# EAGLE design module (EAGLE 9.6.2)

## Sheet 1 of 4
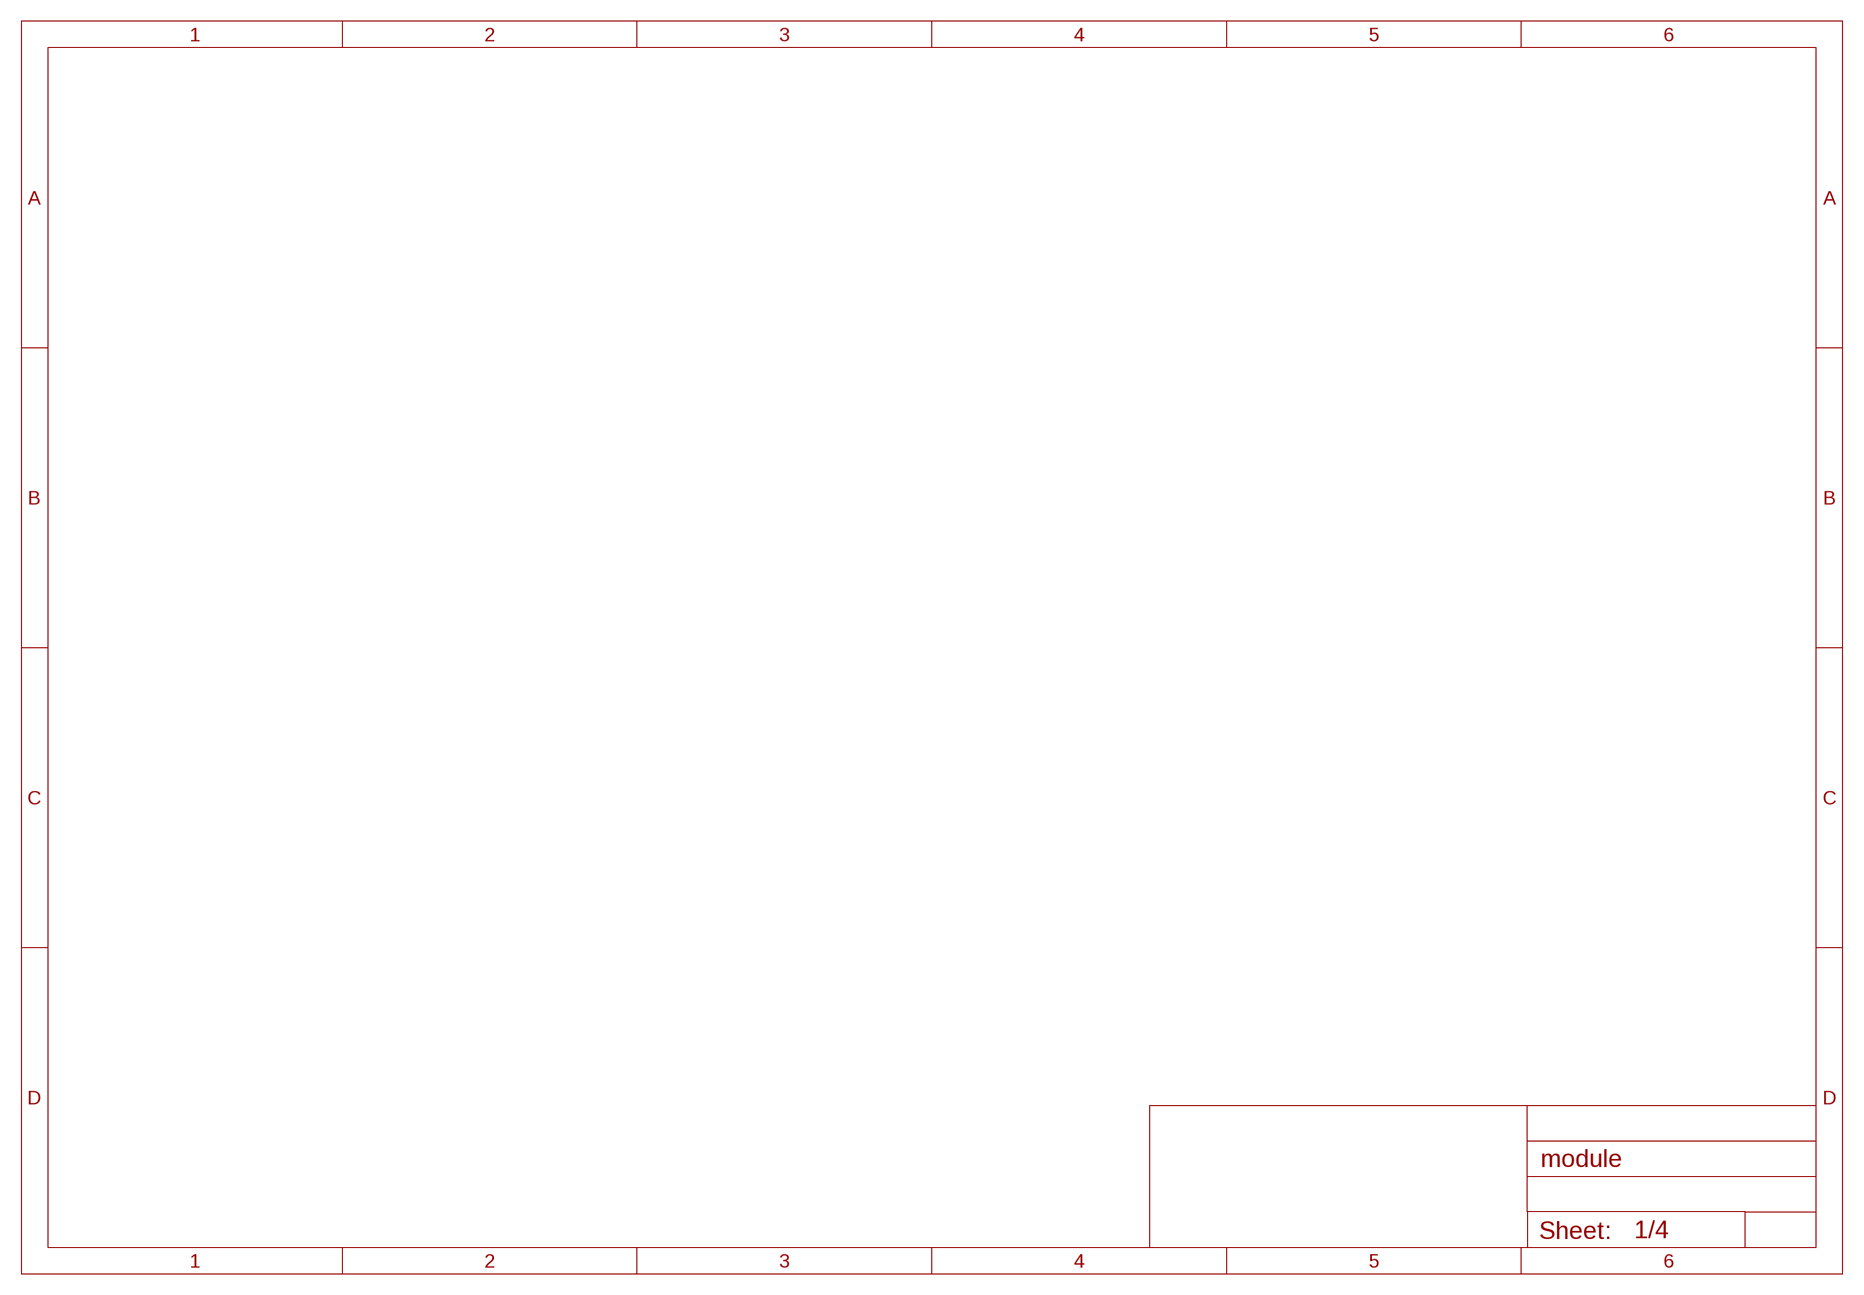
[diagram p0: schematic, sheet 1]

## Sheet 2 of 4
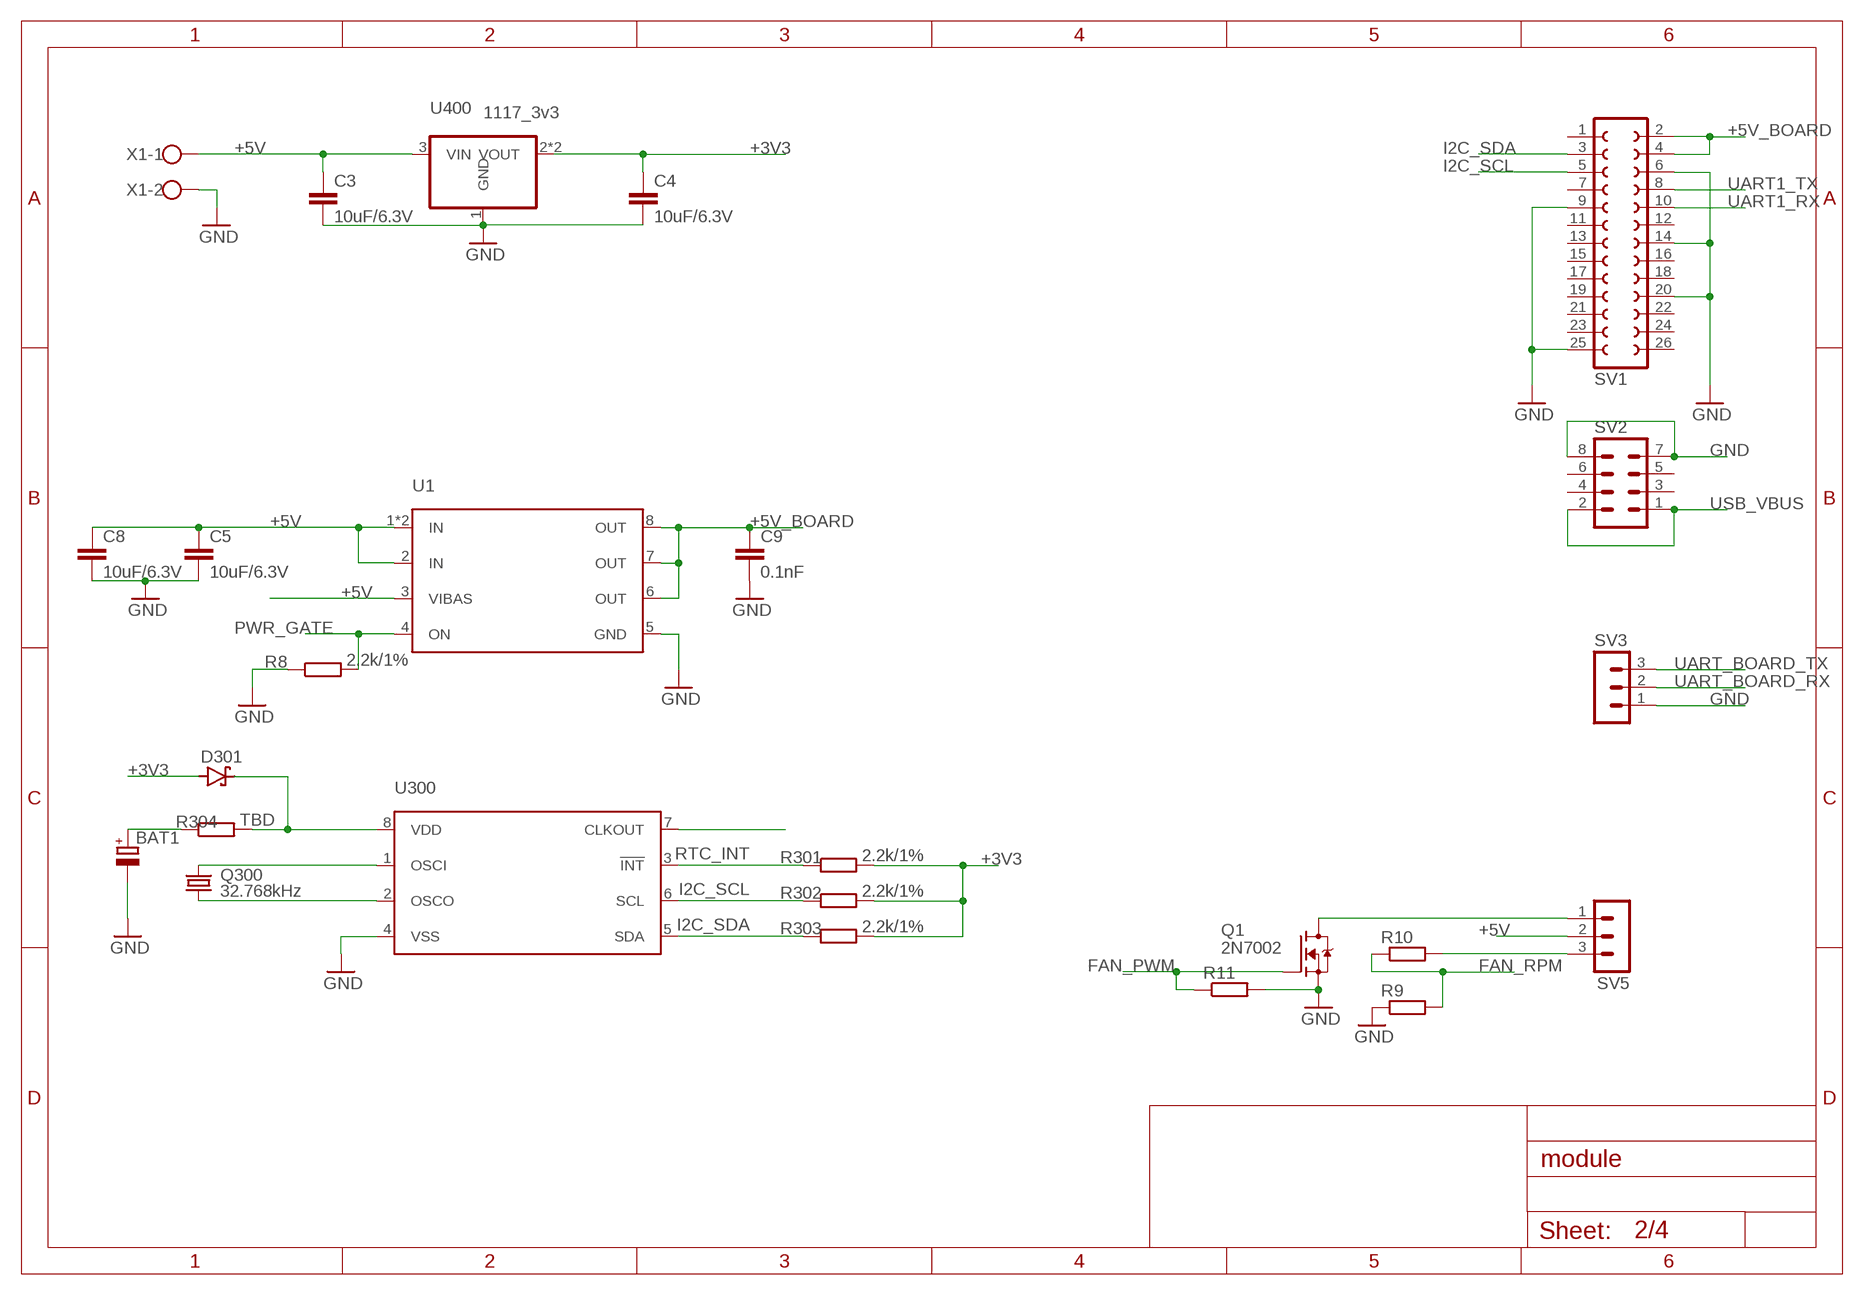
[diagram p1: schematic, sheet 2]

### Parts
BAT1  DCK-3R3E224U-E  [621]
C3  10uF/6.3V  C-EUC1206  [C1206]
C4  10uF/6.3V  C-EUC1206  [C1206]
C5  10uF/6.3V  C-EUC0603  [C0603]
C8  10uF/6.3V  C-EUC0603  [C0603]
C9  0.1nF  C-EUC0603  [C0603]
D301  NSR0320  [SOD323]
Q1  2N7002  [SOT95P240X110-3]
Q300  32.768kHz  CFPX–217-NHT  [3215]
R8  2.2k/1%  R-EU_R0603  [R0603]
R9  R-EU_R0603  [R0603]
R10  R-EU_R0603  [R0603]
R11  R-EU_R0603  [R0603]
R301  2.2k/1%  R-EU_R0603  [R0603]
R302  2.2k/1%  R-EU_R0603  [R0603]
R303  2.2k/1%  R-EU_R0603  [R0603]
R304  TBD  R-EU_R0603  [R0603]
SV1  FE13-2  [FE13-2]
SV2  MA04-2  [MA04-2]
SV3  MA03-1FEMALE  [MA03-1]
SV5  MA03-1  [MA03-1]
U1  DML10M8LDS  [SON65P300X300X80-9T160X240N]
U300  PCF85063ATT  [SOP65P490X110-8N]
U400  1117_3v3  LD1117S50  [SOT230P700X180-4]
X1  W237-102  [EBBA]

### Nets
+3V3: C4.1 D301.A R301.2 R302.2 R303.2 U400.2(VOUT) U400.4(VOUT) ; also sheet 3,4
+5V: C3.1 C5.1 C8.1 SV5.2 U1.1(IN) U1.2(IN) U1.3(VIBAS) U1.9(IN) U400.3(VIN) X1.1
+5V_BOARD: C9.1 SV1.2 SV1.4 U1.6(OUT) U1.7(OUT) U1.8(OUT)
FAN_PWM: Q1.1(G) R11.1 ; also sheet 4
FAN_RPM: R9.2 R10.1 ; also sheet 4
GND: BAT1.- C3.2 C4.2 C5.2 C8.2 C9.2 Q1.2(S) R8.1 R9.1 R11.2 SV1.6 SV1.9 SV1.14 SV1.20 SV1.25 SV2.7 SV2.8 SV3.1 U1.5(GND) U300.4(VSS) U400.1(GND) X1.2 ; also sheet 3,4
I2C_SCL: R302.1 SV1.5 U300.6(SCL) ; also sheet 4
I2C_SDA: R303.1 SV1.3 U300.5(SDA) ; also sheet 4
N$11: U300.7(CLKOUT)
N$14: Q1.3(D) SV5.1
N$16: R10.2 SV5.3
N$21: Q300.1 U300.2(OSCO)
N$22: Q300.2 U300.1(OSCI)
N$23: BAT1.+ R304.1
N$25: D301.K(C) R304.2 U300.8(VDD)
PWR_GATE: R8.2 U1.4(ON) ; also sheet 4
RTC_INT: R301.1 U300.3(!INT)
UART1_RX: SV1.10
UART1_TX: SV1.8
UART_BOARD_RX: SV3.2 ; also sheet 4
UART_BOARD_TX: SV3.3 ; also sheet 4
USB_VBUS: SV2.1 SV2.2
Unconnected: SV1.1 SV1.7 SV1.11 SV1.12 SV1.13 SV1.15 SV1.16 SV1.17 SV1.18 SV1.19 SV1.21 SV1.22 SV1.23 SV1.24 SV1.26 SV2.3 SV2.4 SV2.5 SV2.6

## Sheet 3 of 4
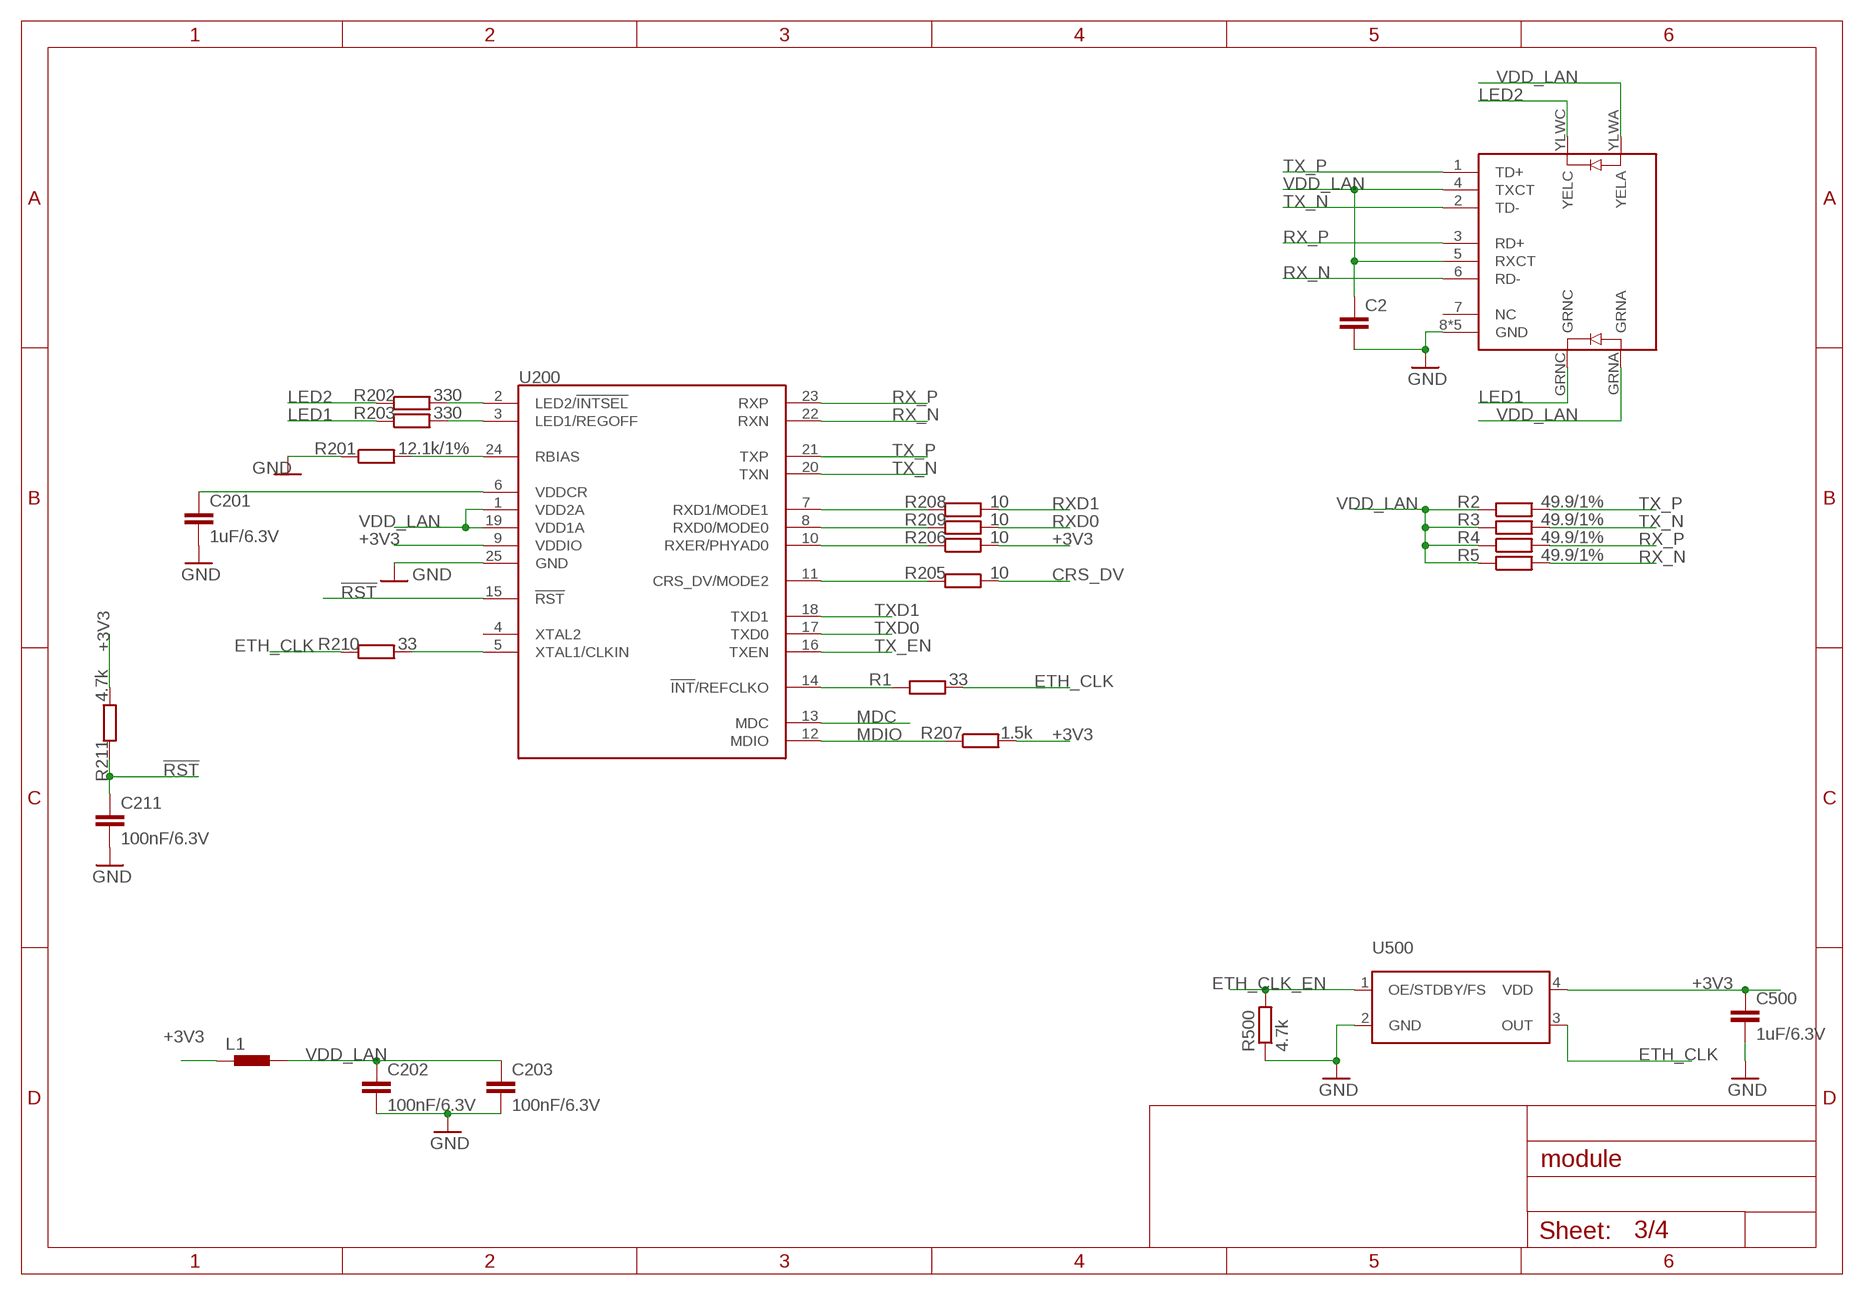
[diagram p2: schematic, sheet 3]

### Parts
C2  C-EUC0603  [C0603]
C201  1uF/6.3V  C-EUC0603  [C0603]
C202  100nF/6.3V  C-EUC0603  [C0603]
C203  100nF/6.3V  C-EUC0603  [C0603]
C211  100nF/6.3V  C-EUC0603  [C0603]
C500  1uF/6.3V  C-EUC0603  [C0603]
J1  ARJM11X1009XXXXX  [LAYOUT1-HORIZ-LEDS]
L1  FER-0603  [FER0603]
R1  33  R-EU_R0603  [R0603]
R2  49.9/1%  R-EU_R0603  [R0603]
R3  49.9/1%  R-EU_R0603  [R0603]
R4  49.9/1%  R-EU_R0603  [R0603]
R5  49.9/1%  R-EU_R0603  [R0603]
R201  12.1k/1%  R-EU_R0603  [R0603]
R202  330  R-EU_R0603  [R0603]
R203  330  R-EU_R0603  [R0603]
R205  10  R-EU_R0603  [R0603]
R206  10  R-EU_R0603  [R0603]
R207  1.5k  R-EU_R0603  [R0603]
R208  10  R-EU_R0603  [R0603]
R209  10  R-EU_R0603  [R0603]
R210  33  R-EU_R0603  [R0603]
R211  4.7k  R-EU_R0603  [R0603]
R500  4.7k  R-EU_R0603  [R0603]
U200  LAN8720A  [QFN50P400X400X100-25T250N]
U500  DSC61XXC  [DIODFN250X200X89-4N]

### Nets
!RST: C211.1 R211.1 U200.15(!RST)
+3V3: C500.1 L1.1 R206.2 R207.2 R211.2 U200.9(VDDIO) U500.4(VDD) ; also sheet 2,4
CRS_DV: R205.2 ; also sheet 4
ETH_CLK: R1.2 R210.1 U500.3(OUT) ; also sheet 4
ETH_CLK_EN: R500.2 U500.1(OE/STDBY/FS) ; also sheet 4
GND: C2.2 C201.2 C202.2 C203.2 C211.2 C500.2 J1.8(GND) J1.P$1(GND) J1.P$2(GND) J1.P$3(GND) J1.P$4(GND) R201.1 R500.1 U200.25(GND) U500.2(GND) ; also sheet 2,4
LED1: J1.GRNC R203.1
LED2: J1.YLWC(YELC) R202.1
MDC: U200.13(MDC) ; also sheet 4
MDIO: R207.1 U200.12(MDIO) ; also sheet 4
N$1: R208.1 U200.7(RXD1/MODE1)
N$2: R210.2 U200.5(XTAL1/CLKIN)
N$3: C201.1 U200.6(VDDCR)
N$4: R202.2 U200.2(LED2/!INTSEL)
N$5: R203.2 U200.3(LED1/REGOFF)
N$7: R209.1 U200.8(RXD0/MODE0)
N$8: R201.2 U200.24(RBIAS)
N$10: R206.1 U200.10(RXER/PHYAD0)
N$13: R205.1 U200.11(CRS_DV/MODE2)
N$17: R1.1 U200.14(!INT!/REFCLKO)
RX_N [eth_diff]: J1.6(RD-) R5.2 U200.22(RXN)
RX_P [eth_diff]: J1.3(RD+) R4.2 U200.23(RXP)
RXD0: R209.2 ; also sheet 4
RXD1: R208.2 ; also sheet 4
TX_EN: U200.16(TXEN) ; also sheet 4
TX_N [eth_diff]: J1.2(TD-) R3.2 U200.20(TXN)
TX_P [eth_diff]: J1.1(TD+) R2.2 U200.21(TXP)
TXD0: U200.17(TXD0) ; also sheet 4
TXD1: U200.18(TXD1) ; also sheet 4
VDD_LAN: C2.1 C202.1 C203.1 J1.4(TXCT) J1.5(RXCT) J1.GRNA J1.YLWA(YELA) L1.2 R2.1 R3.1 R4.1 R5.1 U200.1(VDD2A) U200.19(VDD1A)
Unconnected: J1.7(NC) U200.4(XTAL2)

## Sheet 4 of 4
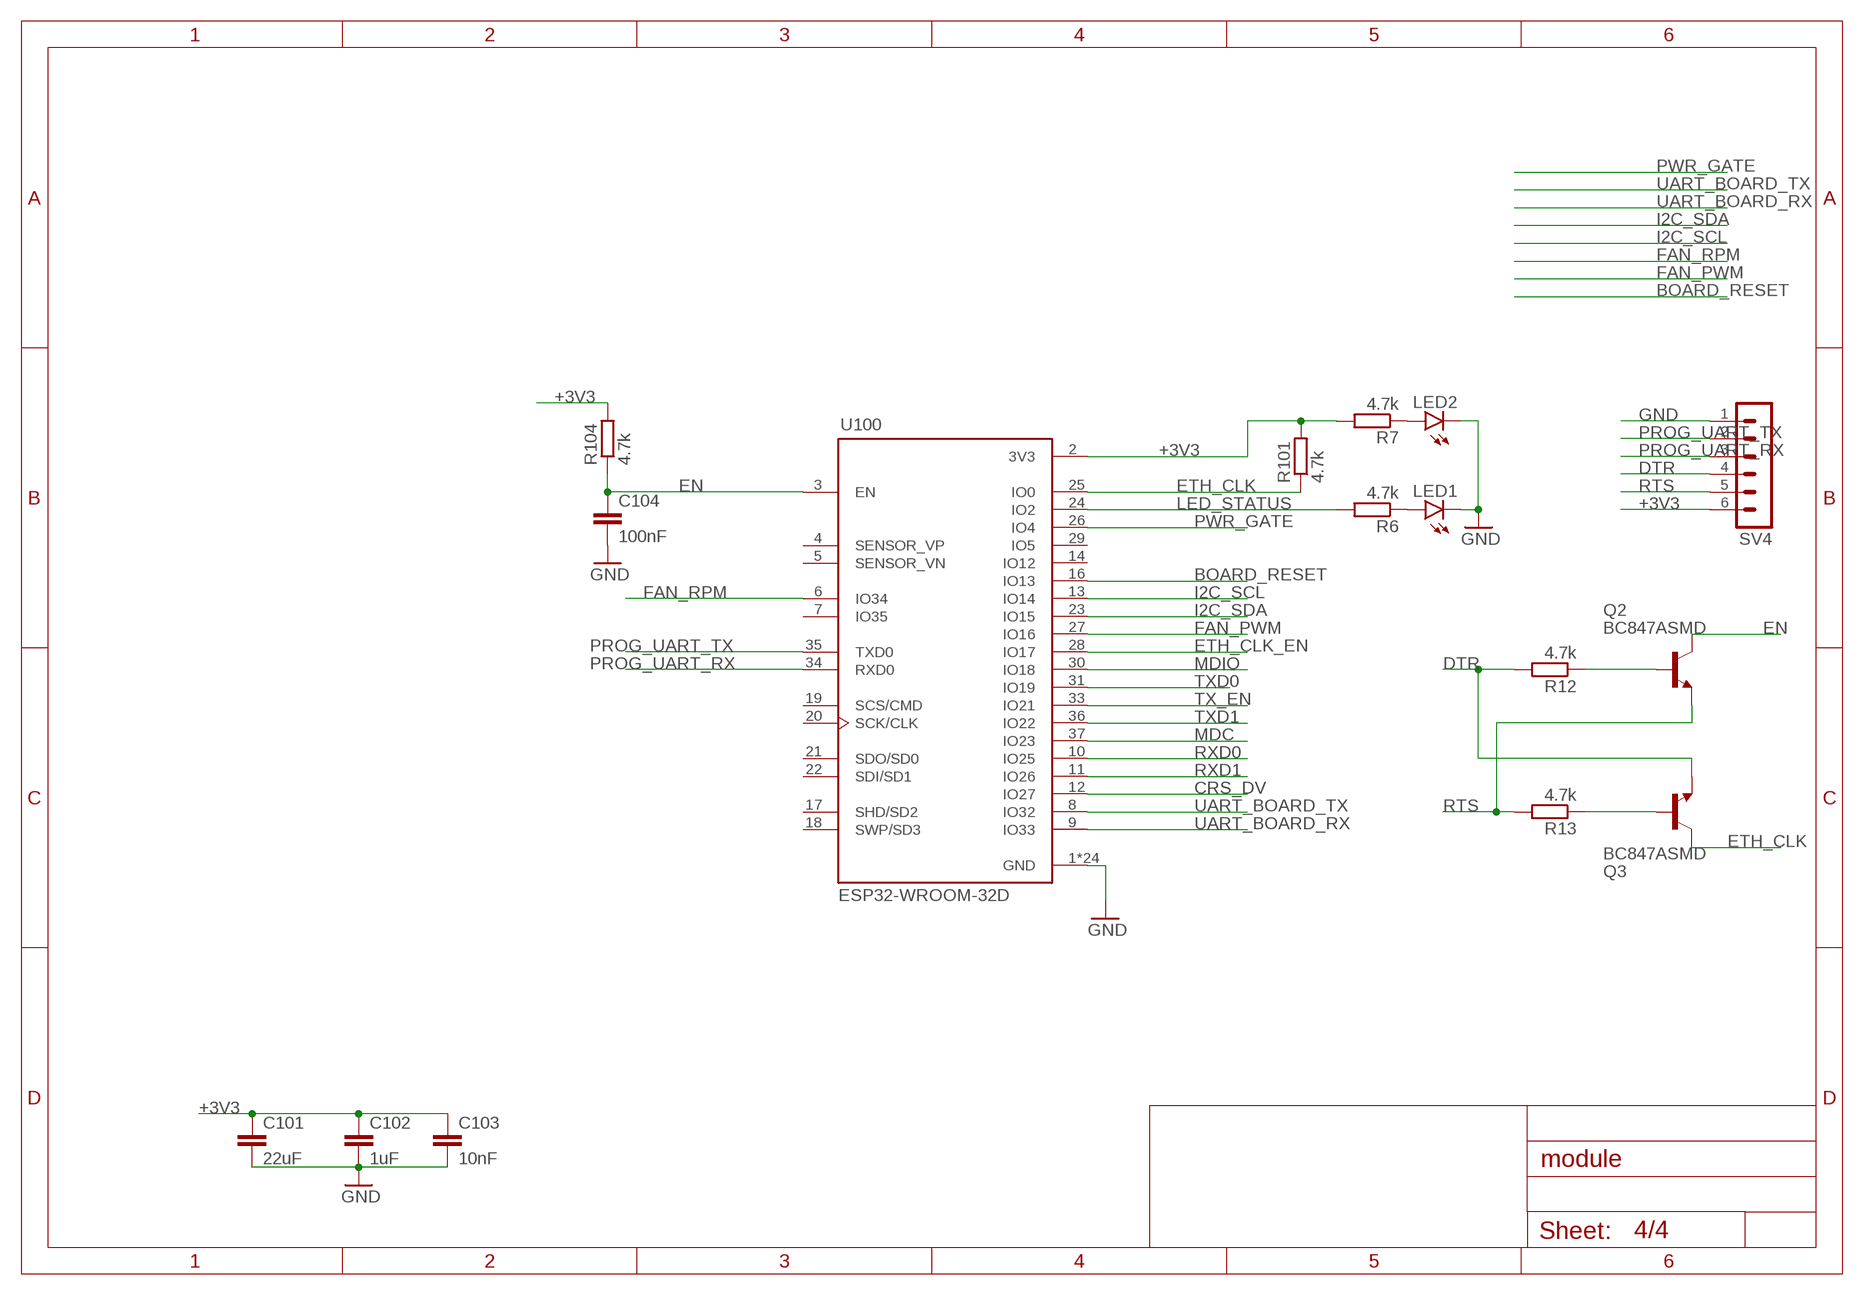
[diagram p3: schematic, sheet 4]

### Parts
C101  22uF  C-EUC1206  [C1206]
C102  1uF  C-EUC0603  [C0603]
C103  10nF  C-EUC0603  [C0603]
C104  100nF  C-EUC0603  [C0603]
LED1  LEDCHIP-LED0805  [CHIP-LED0805]
LED2  LEDCHIP-LED0805  [CHIP-LED0805]
Q2  BC847ASMD  [SOT23]
Q3  BC847ASMD  [SOT23]
R6  4.7k  R-EU_R0603  [R0603]
R7  4.7k  R-EU_R0603  [R0603]
R12  4.7k  R-EU_R0603  [R0603]
R13  4.7k  R-EU_R0603  [R0603]
R101  4.7k  R-EU_R0603  [R0603]
R104  4.7k  R-EU_R0603  [R0603]
SV4  CONN-1X6  [MA06-1]
U100  ESP32-WROOM-32D  [MODULE_ESP32-WROOM-32D]

### Nets
+3V3: C101.1 C102.1 C103.1 R7.2 R101.2 R104.2 SV4.6 U100.2(3V3) ; also sheet 2,3
BOARD_RESET: U100.16(IO13)
CRS_DV: U100.12(IO27) ; also sheet 3
DTR: Q3.2(E) R12.2 SV4.4
EN: C104.1 Q2.3(C) R104.1 U100.3(EN)
ETH_CLK: Q3.3(C) R101.1 U100.25(IO0) ; also sheet 3
ETH_CLK_EN: U100.28(IO17) ; also sheet 3
FAN_PWM: U100.27(IO16) ; also sheet 2
FAN_RPM: U100.6(IO34) ; also sheet 2
GND: C101.2 C102.2 C103.2 C104.2 LED1.C LED2.C SV4.1 U100.1(GND) U100.15(GND) U100.38(GND) U100.39_1(GND) U100.39_2(GND) U100.39_3(GND) U100.39_4(GND) U100.39_5(GND) U100.39_6(GND) U100.39_7(GND) U100.39_8(GND) U100.39_9(GND) U100.39_10(GND) U100.39_11(GND) U100.39_12(GND) U100.39_13(GND) U100.39_14(GND) U100.39_15(GND) U100.39_16(GND) U100.39_17(GND) U100.39_18(GND) U100.39_19(GND) U100.39_20(GND) U100.39_21(GND) ; also sheet 2,3
I2C_SCL: U100.13(IO14) ; also sheet 2
I2C_SDA: U100.23(IO15) ; also sheet 2
LED_STATUS: R6.2 U100.24(IO2)
MDC: U100.37(IO23) ; also sheet 3
MDIO: U100.30(IO18) ; also sheet 3
N$9: LED1.A R6.1
N$12: LED2.A R7.1
N$19: Q2.1(B) R12.1
N$20: Q3.1(B) R13.1
PROG_UART_RX: SV4.3 U100.34(RXD0)
PROG_UART_TX: SV4.2 U100.35(TXD0)
PWR_GATE: U100.26(IO4) ; also sheet 2
RTS: Q2.2(E) R13.2 SV4.5
RXD0: U100.10(IO25) ; also sheet 3
RXD1: U100.11(IO26) ; also sheet 3
TX_EN: U100.33(IO21) ; also sheet 3
TXD0: U100.31(IO19) ; also sheet 3
TXD1: U100.36(IO22) ; also sheet 3
UART_BOARD_RX: U100.9(IO33) ; also sheet 2
UART_BOARD_TX: U100.8(IO32) ; also sheet 2
Unconnected: U100.4(SENSOR_VP) U100.5(SENSOR_VN) U100.7(IO35) U100.14(IO12) U100.17(SHD/SD2) U100.18(SWP/SD3) U100.19(SCS/CMD) U100.20(SCK/CLK) U100.21(SDO/SD0) U100.22(SDI/SD1) U100.29(IO5)

## Library data of the parts
BAT1 = parts-elna:DCK-3R3E224U-E
C2-C5 C8 C9 C101-C104 C201-C203 C211 C500 = rcl:C-EU: CAPACITOR, European symbol; SPICEPREFIX: C
D301 = parts-onsemi:NSR0320
J1 = parts-abracon:ARJM11: Check prices <https://pricing.snapeda.com/parts/ARJM11A3-009-AB-ER2-T/Abracon%20LLC/view-part?ref=eda>
L1 = parts-passives:FER-
LED1 LED2 = led:LED: LED OSRAM: - CHIPLED LG R971, LG N971, LY N971, LG Q971, LY Q971, LO R971, LY R971 LH N974, LH R974 LS Q976, LO Q976, LY Q976 LO Q996 - Hyper CHIPLED LW Q18S LB Q993, LB Q99A, LB R99A - SideLED LS A670, LO A670, LY A670, LG A670, LP A670 LB A673, LV A673, LT A673, LW A673 LH A674 LY A675 LS A676, LA A676, LO A676, LY A676, LW A676 LS A679, LY A679, LG A679 - Hyper Micro SIDELED® LS Y876, LA Y876, LO Y876, LY Y876 LT Y87S - SmartLED LW L88C, LW L88S LB L89C, LB L89S, LG L890 LS L89K, LO L89K, LY L89K LS L896, LA L896, LO L896, LY L896 - TOPLED LS T670, LO T670, LY T670, LG T670, LP T670 LSG T670, LSP T670, LSY T670, LOP T670, LYG T670 LG T671, LOG T671, LSG T671 LB T673, LV T673, LT T673, LW T673 LH T674 LS T676, LA T676, LO T676, LY T676, LB T676, LH T676, LSB T676, LW T676 LB T67C, LV T67C, LT T67C, LS T67K, LO T67K, LY T67K, LW E67C LS E67B, LA E67B, LO E67B, LY E67B, LB E67C, LV E67C, LT E67C LW T67C LS T679, LY T679, LG T679 LS T770, LO T770, LY T770, LG T770, LP T770 LB T773, LV T773, LT T773, LW T773 LH T774 LS E675, LA E675, LY E675, LS T675 LS T776, LA T776, LO T776, LY T776, LB T776 LHGB T686 LT T68C, LB T68C - Hyper Mini TOPLED® LB M676 - Mini TOPLED Santana® LG M470 LS M47K, LO M47K, LY M47K Source: http://www.osram.convergy.de LUXEON: - LUMILED® LXK2-PW12-R00, LXK2-PW12-S00, LXK2-PW14-U00, LXK2-PW14-V00 LXK2-PM12-R00, LXK2-PM12-S00, LXK2-PM14-U00 LXK2-PE12-Q00, LXK2-PE12-R00, LXK2-PE12-S00, LXK2-PE14-T00, LXK2-PE14-U00 LXK2-PB12-K00, LXK2-PB12-L00, LXK2-PB12-M00, LXK2-PB14-N00, LXK2-PB14-P00, LXK2-PB14-Q00 LXK2-PR12-L00, LXK2-PR12-M00, LXK2-PR14-Q00, LXK2-PR14-R00 LXK2-PD12-Q00, LXK2-PD12-R00, LXK2-PD12-S00 LXK2-PH12-R00, LXK2-PH12-S00 LXK2-PL12-P00, LXK2-PL12-Q00, LXK2-PL12-R00 Source: www.luxeon.com KINGBRIGHT: KA-3528ASYC Source: www.kingbright.com
Q1 = parts-onsemi:2N7002
Q2 Q3 = transistor-npn:BC847*: NPN Transistor
Q300 = parts-iqd:CFPX–217: 32.768
R1-R13 R101 R104 R201-R203 R205-R211 R301-R304 R500 = rcl:R-EU_: RESISTOR, European symbol; SPICEPREFIX: R
SV1 = con-lsta:FE13-2: FEMALE HEADER; OC_FARNELL: unknown; OC_NEWARK: unknown
SV2 = con-lstb:MA04-2: PIN HEADER; OC_FARNELL: unknown; OC_NEWARK: unknown
SV3 = parts-passives:MA03-1: PIN HEADER; OC_FARNELL: unknown; OC_NEWARK: unknown
SV4 = parts-passives:CONN-1X6
SV5 = con-lstb:MA03-1: PIN HEADER; OC_FARNELL: unknown; OC_NEWARK: unknown
U1 = parts-diodes:DML10M8LDS
U100 = parts-espressif:ESP32-WROOM-32D: Bluetooth, WiFi 802.11b/g/n, Bluetooth v4.2 + EDR, Class 1, 2 and 3 Transceiver Module 2.4GHz ~ 2.5GHz Integrated, Trace Surface Mount Check prices <https://pricing.snapeda.com/parts/ESP32-WROOM-32D/Espressif%20Systems/view-part?ref=eda>; AVAILABILITY: Bad; DESCRIPTION: 802.11b/g/n, Bluetooth v4.2 +EDR, Class 1, 2 and 3 Transceiver Module 2.4GHz ~ 2.5GHz Integrated, Trace Surface Mount; MF: Espressif Systems; MP: ESP32-WROOM-32D; PACKAGE: Module Espressif Systems; PRICE: None
U200 = parts-microchip:LAN8720A
U300 = parts-nxp:PCF85063A
U400 = parts-st:LD1117
U500 = parts-microchip:DSC61XX
X1 = parts-adam_tech:W237-102: WAGO SCREW CLAMP

## Net classes
1 eth_diff: width 0.25 mm, drill 0.3 mm, clearance 0.25 mm

## Board
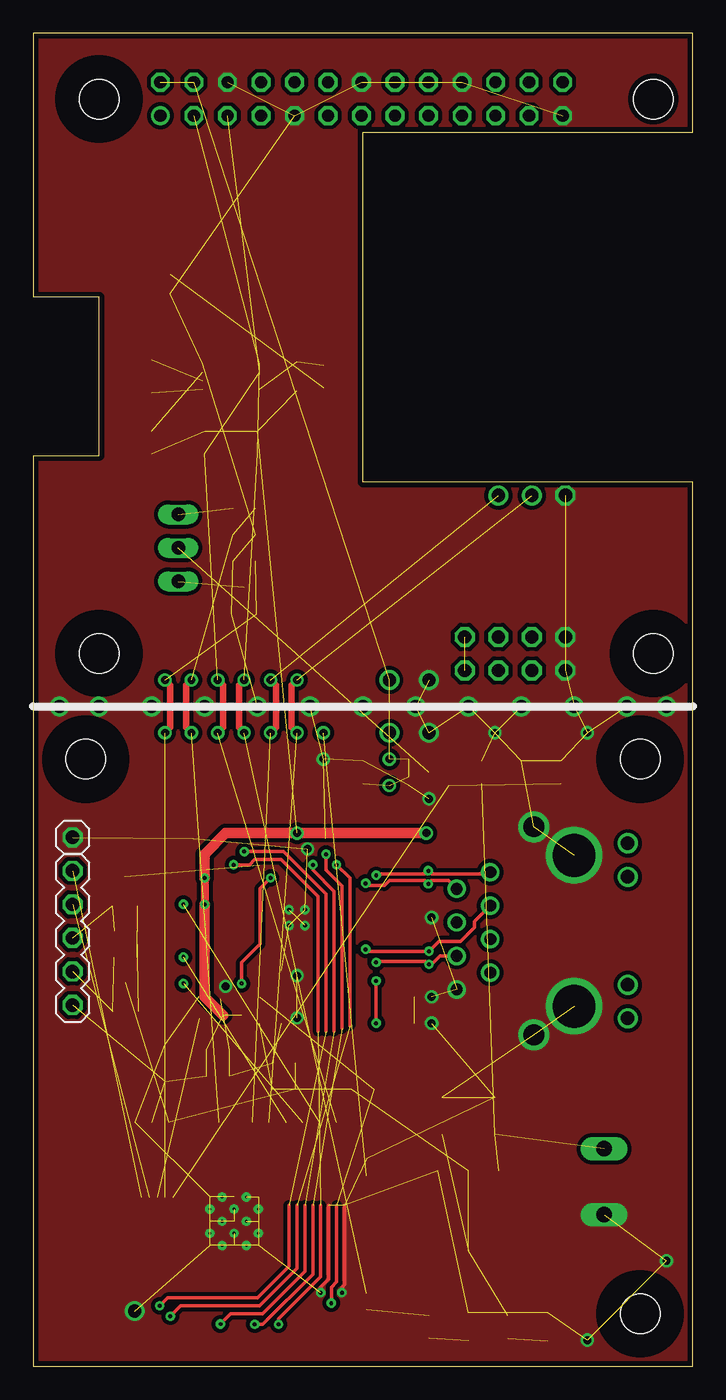
[diagram p4: board, top side]
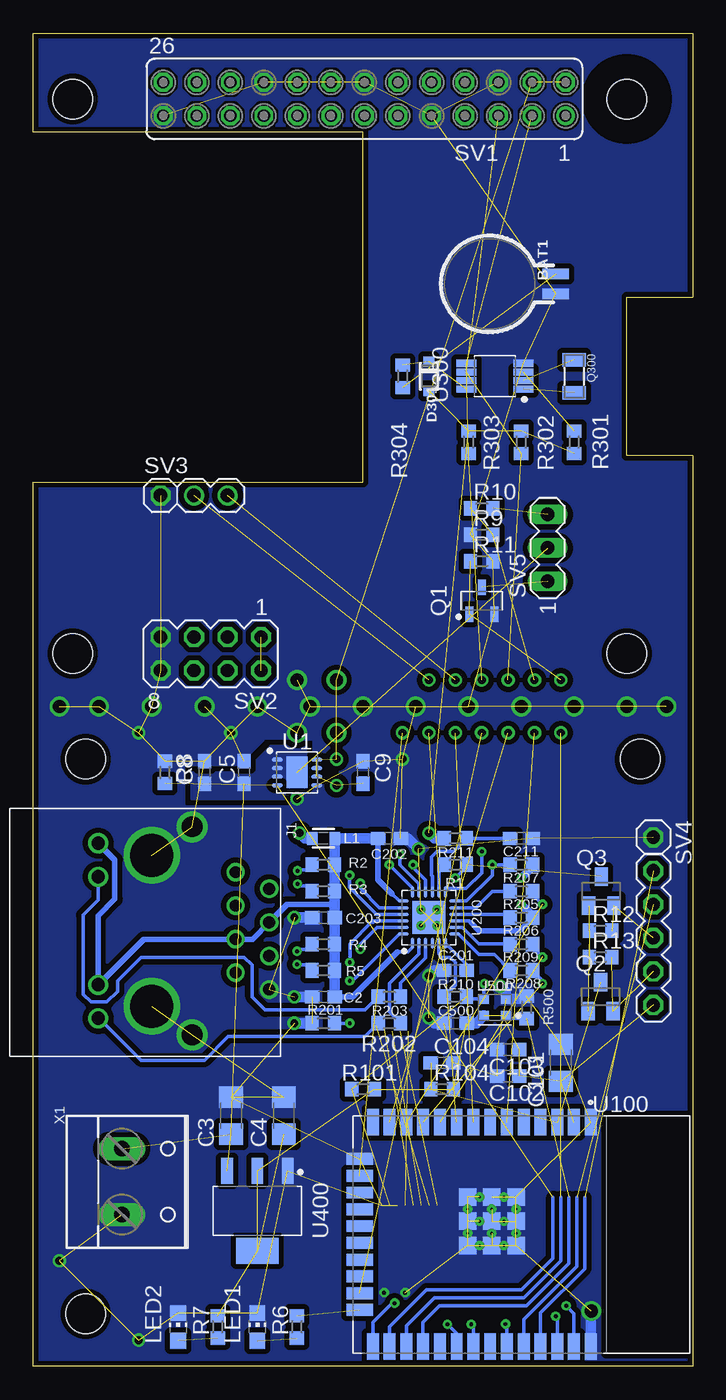
[diagram p5: board, bottom side, seen from below]

Size 50 x 101 mm. Coordinates in mm from the lower left corner, seen from the top.
Outline: 0,0 50,0 50,67 25,67 25,93.5 50,93.5 50,101 0,101 0,81 5,81 5,69 0,69 0,0
Copper layers (1*16): Top 0.035mm / dielectric 0.93mm / Bottom 0.035mm
Design rules "default *": minimum track width 6mil, minimum drill 0.3mm, track to track 6mil, track to pad 6mil, pad to pad 6mil, via to via 6mil, smd to smd 6mil, copper to edge 0.4mm, drill to drill 6mil, minimum pad ring 10mil, minimum via ring 8mil, stop-mask expansion 4mil, vias tented up to drill 0.6mm, thermal gap 10mil
Holes 3 mm at 47,54 5,54 4,46 46,4 47,96 5,96 46,46
tRestrict: area 2,51 to 8,57; area 44,51 to 50,57; area 1,43 to 7,49; area 43,1 to 49,7; area 2,93 to 8,99; area 43,43 to 49,49
bRestrict: area 2,93 to 8,99

### Footprints (pad centres in the part's own frame; a part is rotated, then mirrored left to right if it is on the bottom)
621 = smd 0.8 x 2: + 0.75,-1.6; - -0.75,-1.6
C0603 = smd 1.1 x 1: 1 -0.85,0; 2 0.85,0
C1206 = smd 1.6 x 1.8: 1 -1.4,0; 2 1.4,0
SOD323 = smd 0.8 x 0.8: A 1.1,0; K -1.1,0
LAYOUT1-HORIZ-LEDS = drill 0.89: 1 -4.445,6.35; 2 -3.175,8.89; 3 -1.905,6.35; 4 -0.635,8.89; 5 0.635,6.35; 6 1.905,8.89; 7 3.175,6.35; 8 4.445,8.89 | drill 1.02: GRNA -6.63,-4.06; GRNC -4.09,-4.06; YLWA 4.09,-4.06; YLWC 6.63,-4.06 | drill 3.25: P$1 -5.715,0; P$2 5.715,0 | drill 1.57: P$3 -7.875,3.05; P$4 7.875,3.05
FER0603 = smd 0.8 x 1: 1 -0.85,0; 2 0.85,0
CHIP-LED0805 = smd 1.2 x 1.2: A 0,-1.05; C 0,1.05
SOT95P240X110-3 = smd 1.18 x 0.609: 1 -1.024,0.95; 2 -1.024,-0.95; 3 1.024,0
SOT23 = smd 1 x 1.4: 1 -0.95,-1.1; 2 0.95,-1.1; 3 0,1.1
3215 = smd 1 x 1.8: 1 -1.25,0; 2 1.25,0
R0603 = smd 1 x 1.1: 1 -0.85,0; 2 0.85,0
FE13-2 = drill 0.914: 1 -15.24,1.27 | drill 0.914 octagon: 2 -15.24,-1.27; 3 -12.7,1.27; 4 -12.7,-1.27; 5 -10.16,1.27; 6 -10.16,-1.27; 7 -7.62,1.27; 8 -7.62,-1.27; 9 -5.08,1.27; 10 -5.08,-1.27; 11 -2.54,1.27; 12 -2.54,-1.27; 13 0,1.27; 14 0,-1.27; 15 2.54,1.27; 16 2.54,-1.27; 17 5.08,1.27; 18 5.08,-1.27; 19 7.62,1.27; 20 7.62,-1.27; 21 10.16,1.27; 22 10.16,-1.27; 23 12.7,1.27; 24 12.7,-1.27; 25 15.24,1.27; 26 15.24,-1.27
MA04-2 = drill 1.016 octagon: 1 -3.81,-1.27; 2 -3.81,1.27; 3 -1.27,-1.27; 4 -1.27,1.27; 5 1.27,-1.27; 6 1.27,1.27; 7 3.81,-1.27; 8 3.81,1.27
MA03-1 = drill 1.016 octagon: 1 -2.54,0 | drill 1.016: 2 0,0; 3 2.54,0
MA06-1 = drill 1.016 pad 1.5 octagon: 1 -5.08,0; 2 -2.54,0; 3 0,0; 4 2.54,0; 5 5.08,0; 6 7.62,0
MA03-1' = drill 1.016 long: 1 -2.54,0; 2 0,0; 3 2.54,0
SON65P300X300X80-9T160X240N = smd 0.838 x 0.32: 1 -1.5,0.975; 2 -1.5,0.325; 3 -1.5,-0.325; 4 -1.5,-0.975; 5 1.5,-0.975; 6 1.5,-0.325; 7 1.5,0.325; 8 1.5,0.975 | smd 1.6 x 2.4: 9 0,0
MODULE_ESP32-WROOM-32D = smd 2 x 0.9: 1 -8.5,5.26; 2 -8.5,3.99; 3 -8.5,2.72; 4 -8.5,1.45; 5 -8.5,0.18; 6 -8.5,-1.09; 7 -8.5,-2.36; 8 -8.5,-3.63; 9 -8.5,-4.9; 10 -8.5,-6.17; 11 -8.5,-7.44; 12 -8.5,-8.71; 13 -8.5,-9.98; 14 -8.5,-11.25; 25 8.5,-11.25; 26 8.5,-9.98; 27 8.5,-8.71; 28 8.5,-7.44; 29 8.5,-6.17; 30 8.5,-4.9; 31 8.5,-3.63; 32 8.5,-2.36; 33 8.5,-1.09; 34 8.5,0.18; 35 8.5,1.45; 36 8.5,2.72; 37 8.5,3.99; 38 8.5,5.26 | smd 0.9 x 2: 15 -5.715,-12.25; 16 -4.445,-12.25; 17 -3.175,-12.25; 18 -1.905,-12.25; 19 -0.635,-12.25; 20 0.635,-12.25; 21 1.905,-12.25; 22 3.175,-12.25; 23 4.445,-12.25; 24 5.715,-12.25 | smd 1.33 x 1.33: 39_1 -2.835,-0.405; 39_2 -1,-0.405; 39_3 0.835,-0.405; 39_4 -2.835,-2.24; 39_5 -1,-2.24; 39_6 0.835,-2.24; 39_7 -2.835,-4.075; 39_8 -1,-4.075; 39_9 0.835,-4.075 | drill 0.2 pad 0.3: 39_10 -1.917,-0.405; 39_11 -0.083,-0.405; 39_12 -2.835,-1.323; 39_13 -1,-1.323; 39_14 0.835,-1.323; 39_15 -1.917,-2.24; 39_16 -0.083,-2.24; 39_17 -2.835,-3.158; 39_18 -1,-3.158; 39_19 0.835,-3.158; 39_20 -1.917,-4.075; 39_21 -0.083,-4.075
QFN50P400X400X100-25T250N = smd 0.838 x 0.264: 1 -1.946,1.25; 2 -1.946,0.75; 3 -1.946,0.25; 4 -1.946,-0.25; 5 -1.946,-0.75; 6 -1.946,-1.25; 13 1.946,-1.25; 14 1.946,-0.75; 15 1.946,-0.25; 16 1.946,0.25; 17 1.946,0.75; 18 1.946,1.25 | smd 0.264 x 0.838: 7 -1.25,-1.946; 8 -0.75,-1.946; 9 -0.25,-1.946; 10 0.25,-1.946; 11 0.75,-1.946; 12 1.25,-1.946; 19 1.25,1.946; 20 0.75,1.946; 21 0.25,1.946; 22 -0.25,1.946; 23 -0.75,1.946; 24 -1.25,1.946 | smd 2.5 x 2.5: 25 0,0
SOP65P490X110-8N = smd 1.509 x 0.539: 1 -2.153,0.975; 2 -2.153,0.325; 3 -2.153,-0.325; 4 -2.153,-0.975; 5 2.153,-0.975; 6 2.153,-0.325; 7 2.153,0.325; 8 2.153,0.975
SOT230P700X180-4 = smd 1.965 x 0.889: 1 -3.023,2.3; 2 -3.023,0; 3 -3.023,-2.3 | smd 1.965 x 3.189: 4 3.023,0
DIODFN250X200X89-4N = smd 0.76 x 0.75: 1 -0.82,0.625; 2 -0.82,-0.625; 3 0.82,-0.625; 4 0.82,0.625
EBBA = drill 1.194 long: 1 -2.5,-1.27; 2 2.5,-1.27

### Placement (x,y rotation side)
BAT1  12,82 90 bottom
C2  28,28 180 bottom
C3  35,19 90 bottom
C4  31,19 90 bottom
C5  34,45 90 bottom
C8  37,45 90 bottom
C9  25,45 90 bottom
C101  10,23 90 bottom
C102  14,22 180 bottom
C103  14,24 180 bottom
C104  19,23 0 bottom
C201  18,30 180 bottom
C202  23,40 0 bottom
C203  28,34 180 bottom
C211  13,40 0 bottom
C500  18,26 180 bottom
D301  20,75 270 bottom
J1  41,33 270 bottom
L1  28,40 0 bottom
LED1  33,3 0 bottom
LED2  39,3 0 bottom
Q1  16,58 90 bottom
Q2  7,28 0 bottom
Q3  6.95,36 0 bottom
Q300  9,75 270 bottom
R1  18,38 0 bottom
R2  28,38 180 bottom
R3  28,36 180 bottom
R4  28,32 180 bottom
R5  28,30 180 bottom
R6  30,3 90 bottom
R7  36,3 90 bottom
R8  40,45 270 bottom
R9  16,63 0 bottom
R10  16,65 0 bottom
R11  16,61 0 bottom
R12  7,33 0 bottom
R13  7,31 0 bottom
R101  25,21 0 bottom
R104  19,21 0 bottom
R201  28,26 0 bottom
R202  23,26 0 bottom
R203  23,28 0 bottom
R205  13,36 0 bottom
R206  13,34 0 bottom
R207  13,38 0 bottom
R208  13,30 0 bottom
R209  13,32 0 bottom
R210  18,28 180 bottom
R211  18,40 180 bottom
R301  9,70 270 bottom
R302  13,70 90 bottom
R303  17,70 90 bottom
R304  22,75 90 bottom
R500  12.6,27.2 270 bottom
SV1  24.89,96 180 bottom
SV2  36.53,53.98 180 bottom
SV3  37.8,65.98 0 bottom
SV4  3,35 270 bottom
SV5  [MA03-1']  11,62 90 bottom
U1  30,45 0 bottom
U100  13,10 270 bottom
U200  20,34 90 bottom
U300  15,75 180 bottom
U400  33,11.8 270 bottom
U500  15,27.2 180 bottom
X1  42,14 270 bottom

### Tracks (layer width: path | path; a pad name or v marks a point on that pad's centre or on a via)
!RST
  Bottom 0.25: U200.15 19.75,37.15 19.8,37.2 19.8,38.6 19.4,39 18.15,39 R211.1 C211.1
+3V3  (via drill 0.3, 0.6)  (17 unrouted)
  Top 0.6: v13,37 v13,35
  Top 0.8: v29.8,40.4 v20,40.4 14.6,40.4 13,38.8 v13,37 | v13,35 13,28 14.4,26.6
  Bottom 0.25: U200.9 16.95,33.75 16.8,33.6
  Bottom 0.4: 16.8,33.6 16.2,33 13.15,33 R206.2
  Bottom 0.6: R207.2 12.15,37.85 v13,37 | v13,35 12.15,34.15 R206.2
  Bottom 0.8: R211.2 19.6,40 v20,40.4 | C500.1 16.39,26 U500.4 | L1.1 29.4,40 v29.8,40.4
+5V  (4 unrouted)
  pour Bottom (isolate 0.4, rank 3, no thermals): 29.3,47 32,47 34,45 38,45 38,43 29.3,43
+5V_BOARD  (via drill 0.6, 1)  (9 unrouted)
  other vias: 27,46 27,44 27,48 27,52
BOARD_RESET  (via drill 0.6)  (1 unrouted)
  other vias: 22,48
CRS_DV  (via drill 0.3)  (1 unrouted)
  Bottom 0.25: R205.2 12.15,35.77 v11.39,35.01
DTR  (2 unrouted)
EN  (3 unrouted)
ETH_CLK  (via drill 0.3)  (4 unrouted)
  Top 0.25: v18,37 17.2,36.2 17.2,32 15.8,30.6 v15.8,29 | v22.6,4.8 22.6,6 23,6.4 23,12.2
  Bottom 0.25: R1.2 17.15,37.85 v18,37 | R210.1 16.98,27.82 U500.3 15.82,28.98 v15.8,29 | U100.25 24.25,3.35 22.8,4.8 v22.6,4.8
ETH_CLK_EN  (1 unrouted)
  Bottom 0.25: U500.1 13.96,26.35 R500.2 | U100.28 20.44,3.36 19.2,4.6 12.6,4.6 9.4,7.8 9.4,12.8
FAN_PWM  (via drill 0.6)  (3 unrouted)
  Top 0.5: v10,52 10.4,51.6 10.4,48.4 v10,48
  Bottom 0.25: U100.27 21.71,3.09 19.6,5.2 12.8,5.2 10,8 10,12.8
FAN_RPM  (via drill 0.6)  (3 unrouted)
  Top 0.5: v12,48 11.6,48.4 11.6,51.6 v12,52
GND  (via drill 0.3, 0.6, 1)  (93 unrouted)
  Top 0.25: v21.8,5.6 21.8,6 22.4,6.6 22.4,12.2 | v23.4,5.6 23.4,6 23.6,6.2 23.6,12.2
  Bottom 0.8: C203.2 v30.2,34 | C2.2 v30.2,28 | R201.1 v30.2,26 | C202.2 21.6,40 v20.8,39.2 | C201.2 19.6,30 v20,29.6 | C500.2 19.6,26 v20,26.4 | R500.1 12.82,27.82 U500.2 14.18,28.37 v14.6,28.79 | U100.38 7.74,4.16 v7.7,4.2
  other vias: 42,48 35,48 22,46 30,43 19.4,34.6 20.6,34.6 20.6,33.4 19.4,33.4 2,50 5,50 9,50 13,50 17,50 21,50 25,50 29,50 33,50 37,50 41,50 45,50 48,50 30,48 30,52 42,2 48,8
  pour Top (isolate 0.3, rank 6, no thermals): -1,102 51,102 51,0.2 -1,0.2
  pour Bottom (isolate 0.4, rank 6, no thermals): -2,103 52,103 52,-1 -2,-1
I2C_SCL  (via drill 0.6)  (4 unrouted)
  Top 0.5: v14,48 14.4,48.4 14.4,51.6 v14,52
I2C_SDA  (via drill 0.6)  (4 unrouted)
  Top 0.5: v16,48 15.6,48.4 15.6,51.6 v16,52
LED1
  Bottom 0.25: R203.1 24.85,27 32.4,27 33.4,28 33.4,30.4 34,31 41.8,31 43.6,29.2 43.6,28.4 44.4,27.6 45.6,27.6 46.2,28.2 46.2,34.2 45.06,35.34 J1.GRNC
LED2
  Bottom 0.25: R202.1 24.85,25 35.2,25 37,23.2 41.8,23.2 44.97,26.37 J1.YLWC
LED_STATUS  (1 unrouted)
MDC  (via drill 0.3)  (1 unrouted)
  Top 0.25: v16,39 19,39 22.2,35.8 22.2,25.4 | v9.6,4.6 10.2,5.2 17,5.2 19.4,7.6 19.4,12.2
  Bottom 0.25: U200.13 18.75,36.15 18.7,36.2 17.2,36.2 16,37.4 v16,39 | U100.37 9.01,4.01 v9.6,4.6
MDIO  (via drill 0.3)  (1 unrouted)
  Top 0.25: v15.2,38 16.4,38 16.8,38.4 18.8,38.4 21.6,35.6 21.6,25.4 | v18.6,3.2 18.6,3.6 21.8,6.8 21.8,12.2
  Bottom 0.25: U200.12 17.15,35.25 15.2,37.2 v15.2,38 R207.1 | U100.30 17.9,2.5 v18.6,3.2
N$1
  Bottom 0.25: U200.7 17.75,32.75 16.2,31.2 15.05,31.2 R208.1
N$2
  Bottom 0.25: U200.5 19.25,31.25 19,31 18.4,31 18,30.6 18,28.85 R210.2
N$3
  Bottom 0.25: U200.6 17.15,30.45 C201.1
N$4
  Bottom 0.25: U200.2 20.75,31.25 23,29 23,26.85 R202.2
N$5
  Bottom 0.25: U200.3 20.25,30.95 22.15,29.05 R203.2
N$7
  Bottom 0.25: U200.8 17.45,33.25 16.2,32 R209.1
N$8  (via drill 0.3)
  Top 0.25: v26,29.2 v26,26
  Bottom 0.25: U200.24 22.25,32.75 25.8,29.2 v26,29.2 | v26,26 R201.2
N$9  (1 unrouted)
N$10
  Bottom 0.25: U200.10 14.1,34.25 R206.1
N$12  (1 unrouted)
N$13
  Bottom 0.25: U200.11 16.45,34.75 15.2,36 R205.1
N$14  (1 unrouted)
N$16  (1 unrouted)
N$17
  Bottom 0.25: U200.14 19.25,37.6 R1.1
N$19  (1 unrouted)
N$20  (1 unrouted)
N$21  (1 unrouted)
N$22  (1 unrouted)
N$23  (1 unrouted)
N$25  (2 unrouted)
PROG_UART_RX  (1 unrouted)
  Bottom 0.25: U100.34 12.82,3.58 8.8,7.6 8.8,12.8
PROG_UART_TX  (1 unrouted)
  Bottom 0.25: U100.35 11.55,4.05 8.2,7.4 8.2,12.8
PWR_GATE  (2 unrouted)
  Bottom 0.25: U100.26 22.98,3.02 20.2,5.8 13,5.8 10.6,8.2 10.6,12.8
RTC_INT  (1 unrouted)
RTS  (2 unrouted)
RX_N  (via drill 0.3)
  Top 0.25: J1.6 30.84,31.09 30.2,30.45 v30,30.45 29.75,30.7 26.1,30.7 v26,30.6
  Bottom 0.25: v30,30.45 29.95,30.4 29.25,30.4 R5.2 | v26,30.6 26,32 24.3,33.7 | U200.22 24.25,33.75 24.3,33.7 | 24.3,33.7 24.25,33.65
RX_P  (via drill 0.3)
  Top 0.25: J1.3 33.45,33.7 33.45,33.25 32.4,32.2 30.75,32.2 v30,31.45 25.35,31.45 v25.2,31.6
  Bottom 0.25: U200.23 23.95,33.25 25.2,32 v25.2,31.6 | v30,31.45 29.85,31.6 29.25,31.6 R4.2
RXD0  (via drill 0.3)  (1 unrouted)
  Bottom 0.25: R209.2 12.15,31.77 v11.39,31.01
RXD1  (via drill 0.3)  (1 unrouted)
  Bottom 0.25: R208.2 11.4,29.25 v11.4,29
TX_EN  (via drill 0.3)  (1 unrouted)
  Top 0.25: v21.2,38 21.2,37.6 22.8,36 22.8,25.4 | v14.2,3.22 14.98,4 17.4,4 20.6,7.2 20.6,12.2
  Bottom 0.25: U200.16 20.25,36.85 21.2,37.8 v21.2,38 | U100.33 14.09,3.11 v14.2,3.22
TX_N  (via drill 0.3)
  Top 0.25: v25.2,36.6 25.38,36.42 26.62,36.42 27,36.8 29.7,36.8 v29.95,36.55 30.2,36.8 31.48,36.8 J1.2
  Bottom 0.25: U200.20 23.75,34.75 25.2,36.2 v25.2,36.6 | v29.95,36.55 29.8,36.4 29.25,36.4 R3.2
TX_P  (via drill 0.3)
  Top 0.25: J1.1 34.51,37.3 30.2,37.3 v29.95,37.55 29.7,37.3 26.11,37.3 v26.01,37.2
  Bottom 0.25: v26.01,37.2 26.01,36.3 23.96,34.25 U200.21 | v29.95,37.55 29.9,37.6 29.25,37.6 R2.2
TXD0  (via drill 0.3)  (1 unrouted)
  Top 0.25: v22.2,38.8 22.2,37.6 23.4,36.4 23.4,25.6 | v16.8,3.2 17.4,3.2 21.2,7 21.2,12.2
  Bottom 0.25: U200.17 20.75,36.55 22.2,38 v22.2,38.8 | U100.31 16.63,3.03 v16.8,3.2
TXD1  (via drill 0.3)  (1 unrouted)
  Top 0.25: v23,38 24,37 24,25.8 | v10.4,3.8 11.2,4.6 17.17,4.6 20,7.43 20,12.2
  Bottom 0.25: U200.18 21.25,36.25 v23,38 | U100.36 10.28,3.68 v10.4,3.8
UART_BOARD_RX  (via drill 0.6)  (2 unrouted)
  Top 0.5: v20,48 19.6,48.4 19.6,51.6 v20,52
UART_BOARD_TX  (via drill 0.6)  (2 unrouted)
  Top 0.5: v18,48 18.4,48.4 18.4,51.6 v18,52
USB_VBUS  (1 unrouted)
VDD_LAN
  Bottom 0.25: U200.19 22.25,35.25 22.8,35.8 | U200.1 21.25,31.75 21.6,31.4 22.4,31.4
  Bottom 0.4: C202.1 23.85,36.85 22.8,35.8 | R4.1 27.15,32.15 | R3.1 27.15,35.05 27.2,35 30.75,35 J1.4 33.38,32.36 J1.5 41.6,32.36 J1.YLWA 45.06,34.14 43.8,35.4 43.8,38.37 J1.GRNA | C2.1 25.8,28 22.4,31.4
  Bottom 0.8: C2.1 R5.1 R4.1 C203.1 R3.1 R2.1 L1.2 C202.1